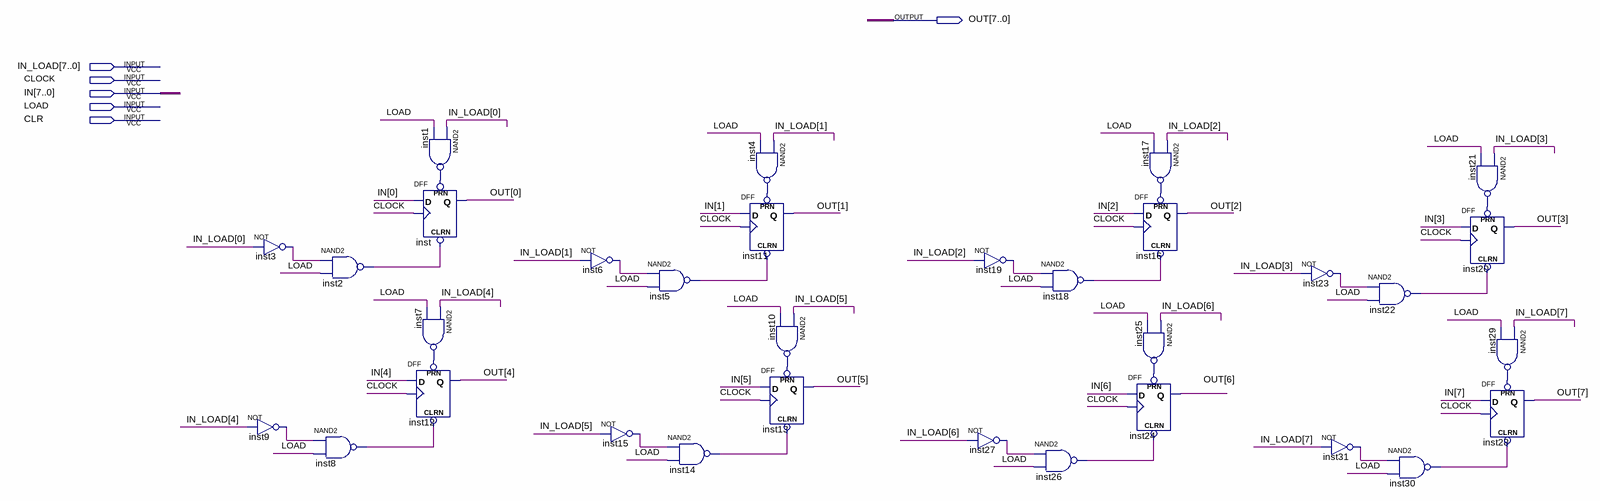
[diagram p0: schematic sheet]
// Quartus schematic REGISTER_8bit.bdf as structural Verilog: 32 symbols, 6 pins
module REGISTER_8bit (
  input  [7:0] IN_LOAD,
  input  CLOCK,
  input  [7:0] IN,
  input  LOAD,
  input  CLR,
  output [7:0] OUT
);

  wire inst1_out, inst2_out, inst3_out, inst4_out, inst5_out, inst6_out, inst7_out, inst8_out, inst9_out,
       inst10_out, inst14_out, inst15_out, inst17_out, inst18_out, inst19_out, inst21_out, inst22_out,
       inst23_out, inst25_out, inst26_out, inst27_out, inst29_out, inst30_out, inst31_out;

  not inst3 (inst3_out, IN_LOAD[0]);
  not inst9 (inst9_out, IN_LOAD[4]);
  nand inst2 (inst2_out, inst3_out, LOAD);
  nand inst8 (inst8_out, inst9_out, LOAD);
  nand inst1 (inst1_out, IN_LOAD[0], LOAD);
  DFF inst (.CLRN(inst2_out), .CLK(CLOCK), .D(IN[0]), .PRN(inst1_out), .Q(OUT[0]));
  nand inst7 (inst7_out, IN_LOAD[4], LOAD);
  DFF inst12 (.CLRN(inst8_out), .CLK(CLOCK), .D(IN[4]), .PRN(inst7_out), .Q(OUT[4]));
  not inst6 (inst6_out, IN_LOAD[1]);
  not inst15 (inst15_out, IN_LOAD[5]);
  nand inst5 (inst5_out, inst6_out, LOAD);
  nand inst14 (inst14_out, inst15_out, LOAD);
  nand inst4 (inst4_out, IN_LOAD[1], LOAD);
  DFF inst11 (.CLRN(inst5_out), .CLK(CLOCK), .D(IN[1]), .PRN(inst4_out), .Q(OUT[1]));
  nand inst10 (inst10_out, IN_LOAD[5], LOAD);
  DFF inst13 (.CLRN(inst14_out), .CLK(CLOCK), .D(IN[5]), .PRN(inst10_out), .Q(OUT[5]));
  not inst19 (inst19_out, IN_LOAD[2]);
  not inst27 (inst27_out, IN_LOAD[6]);
  nand inst26 (inst26_out, inst27_out, LOAD);
  nand inst18 (inst18_out, inst19_out, LOAD);
  nand inst17 (inst17_out, IN_LOAD[2], LOAD);
  DFF inst16 (.CLRN(inst18_out), .CLK(CLOCK), .D(IN[2]), .PRN(inst17_out), .Q(OUT[2]));
  nand inst25 (inst25_out, IN_LOAD[6], LOAD);
  DFF inst24 (.CLRN(inst26_out), .CLK(CLOCK), .D(IN[6]), .PRN(inst25_out), .Q(OUT[6]));
  not inst23 (inst23_out, IN_LOAD[3]);
  not inst31 (inst31_out, IN_LOAD[7]);
  nand inst22 (inst22_out, inst23_out, LOAD);
  nand inst30 (inst30_out, inst31_out, LOAD);
  DFF inst20 (.CLRN(inst22_out), .CLK(CLOCK), .D(IN[3]), .PRN(inst21_out), .Q(OUT[3]));
  nand inst21 (inst21_out, IN_LOAD[3], LOAD);
  nand inst29 (inst29_out, IN_LOAD[7], LOAD);
  DFF inst28 (.CLRN(inst30_out), .CLK(CLOCK), .D(IN[7]), .PRN(inst29_out), .Q(OUT[7]));
endmodule
